# Altium project HSC_19e.PrjPcb
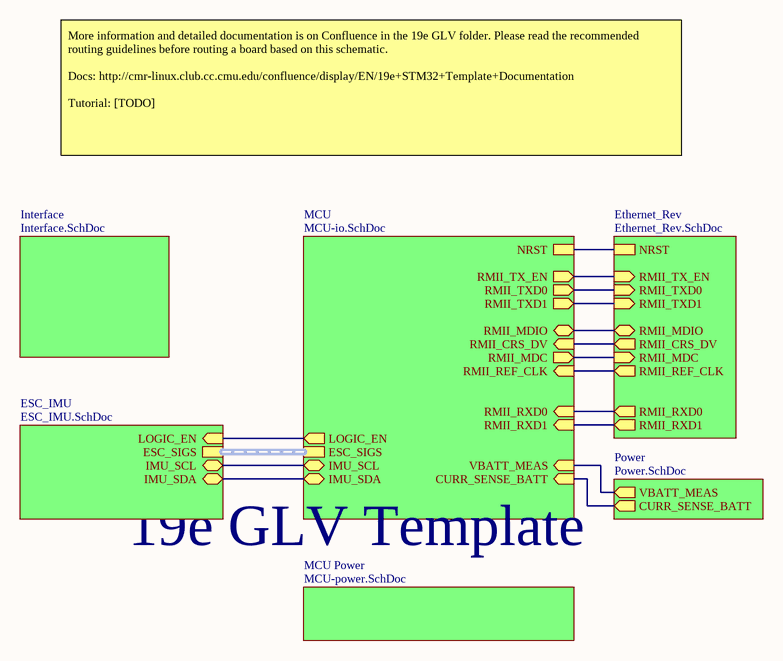
[diagram p0: Main.SchDoc]
7 sheets, 104 parts. Net scope: hierarchical (ports join the sheet entries above them; power ports are global).
Board file: PCB1.PcbDoc
Sheets:
  Main.SchDoc
    MCU = MCU-io.SchDoc
    Power = Power.SchDoc
    MCU Power = MCU-power.SchDoc
    Interface = Interface.SchDoc
    ESC_IMU = ESC_IMU.SchDoc
    Ethernet_Rev = Ethernet_Rev.SchDoc

## Sheet Main.SchDoc
size A

### Sub-sheets
ESC_IMU = ESC_IMU.SchDoc: IMU_SCL (bidir), LOGIC_EN (in), IMU_SDA (bidir), ESC_SIGS (harness ESC_SIG)
Ethernet_Rev = Ethernet_Rev.SchDoc: RMII_RXD1 (out), RMII_TXD1 (in), RMII_MDC (in), RMII_CRS_DV (out), RMII_RXD0 (out), RMII_REF_CLK (out), RMII_MDIO (bidir), RMII_TXD0 (in), RMII_TX_EN (in), NRST
Interface = Interface.SchDoc: no entries
MCU = MCU-io.SchDoc: CURR_SENSE_BATT (in), VBATT_MEAS (in), NRST, RMII_TXD1 (out), LOGIC_EN (out), ESC_SIGS (harness ESC_SIG), RMII_MDIO (bidir), RMII_CRS_DV (in), RMII_RXD0 (in), RMII_MDC (out), IMU_SDA (bidir), RMII_TX_EN (out), RMII_TXD0 (out), RMII_REF_CLK (in), IMU_SCL (bidir), RMII_RXD1 (in)
MCU Power = MCU-power.SchDoc: no entries
Power = Power.SchDoc: CURR_SENSE_BATT (out), VBATT_MEAS (out)

### Nets
CURR_SENSE_BATT: sheet MCU/CURR_SENSE_BATT, sheet Power/CURR_SENSE_BATT
I2C1_SCL: sheet MCU/IMU_SCL, sheet ESC_IMU/IMU_SCL
I2C1_SDA: sheet MCU/IMU_SDA, sheet ESC_IMU/IMU_SDA
LOGIC_EN: sheet MCU/LOGIC_EN, sheet ESC_IMU/LOGIC_EN
NRST: sheet MCU/NRST, sheet Ethernet_Rev/NRST
RMII_CRS_DV: sheet MCU/RMII_CRS_DV, sheet Ethernet_Rev/RMII_CRS_DV
RMII_MDC: sheet MCU/RMII_MDC, sheet Ethernet_Rev/RMII_MDC
RMII_MDIO: sheet MCU/RMII_MDIO, sheet Ethernet_Rev/RMII_MDIO
RMII_REF_CLK: sheet MCU/RMII_REF_CLK, sheet Ethernet_Rev/RMII_REF_CLK
RMII_RXD0: sheet MCU/RMII_RXD0, sheet Ethernet_Rev/RMII_RXD0
RMII_RXD1: sheet MCU/RMII_RXD1, sheet Ethernet_Rev/RMII_RXD1
RMII_TX_EN: sheet MCU/RMII_TX_EN, sheet Ethernet_Rev/RMII_TX_EN
RMII_TXD0: sheet MCU/RMII_TXD0, sheet Ethernet_Rev/RMII_TXD0
RMII_TXD1: sheet MCU/RMII_TXD1, sheet Ethernet_Rev/RMII_TXD1
VBATT_MEAS: sheet MCU/VBATT_MEAS, sheet Power/VBATT_MEAS

### Buses and harness runs
harness sheet ESC_IMU/ESC_SIGS = sheet MCU/ESC_SIGS

### Notes on the sheet
- More information and detailed documentation is on Confluence in the 19e GLV folder. Please read the recommended routing guidelines before routing a board based on this schematic.
  Docs: http://cmr-linux.club.cc.cmu.edu/confluence/display/EN/19e+STM32+Template+Documentation
  Tutorial: [TODO]
- 19e GLV Template

## Sheet MCU-io.SchDoc
size A4
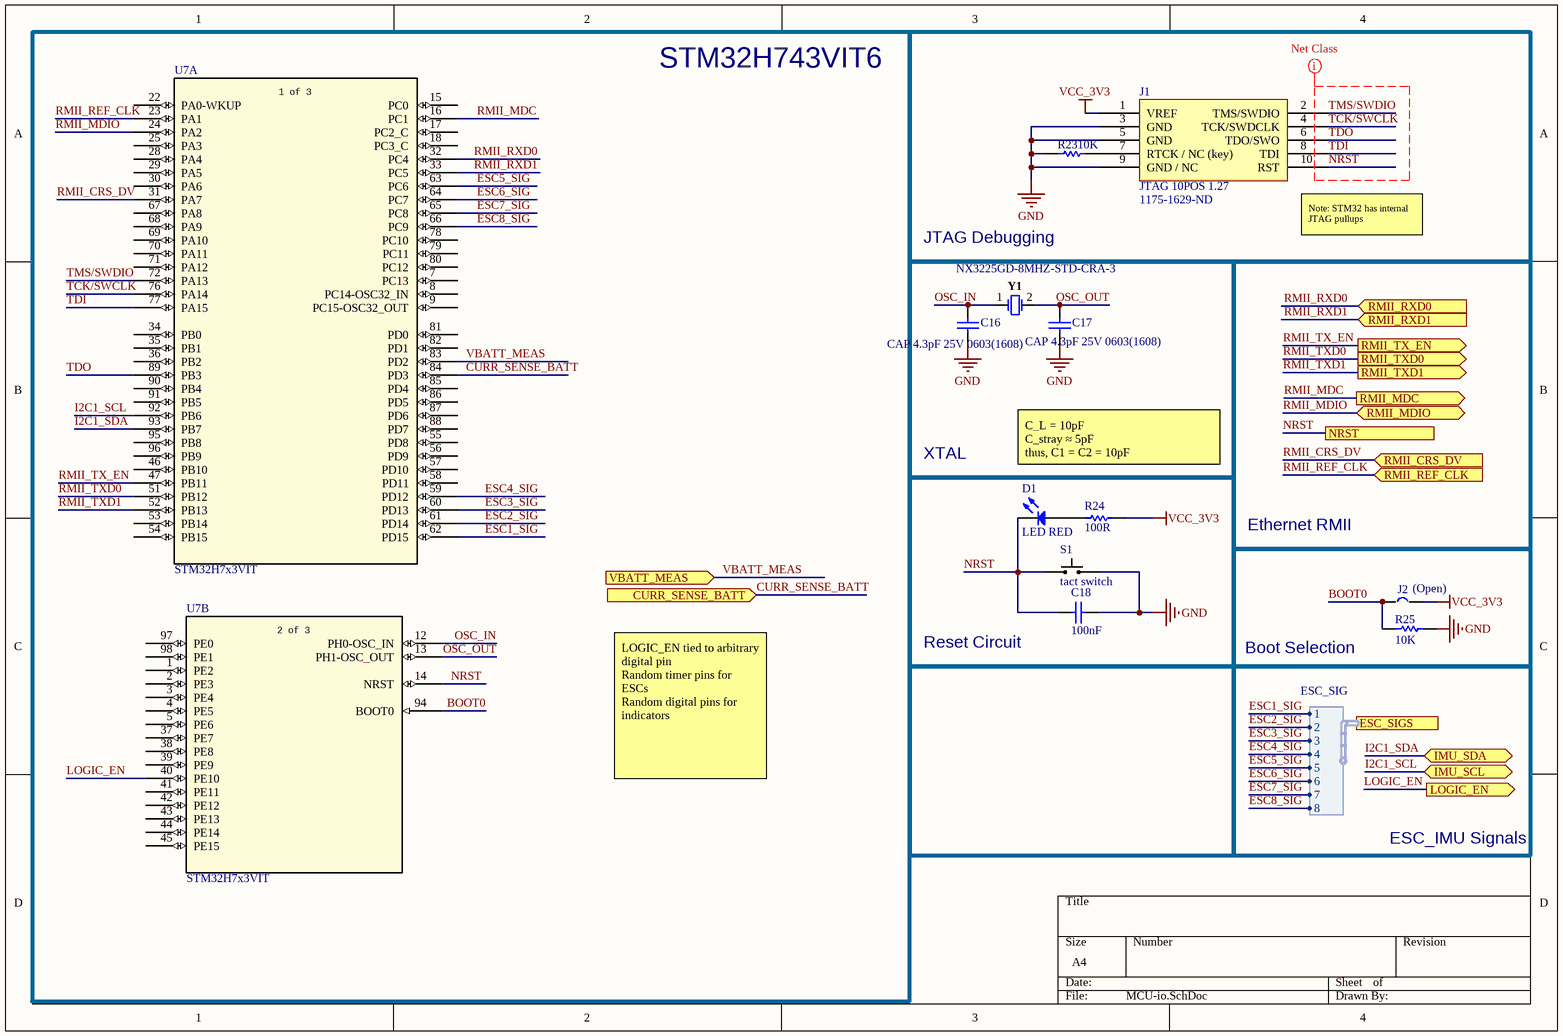
[diagram p1: MCU-io.SchDoc]

### Parts
C16  CAP 4.3pF 25V 0603(1608)  [CAPC0603(1608)100_L]
C17  CAP 4.3pF 25V 0603(1608)  [CAPC0603(1608)100_L]
C18  100nF  [CAPC0603(1608)100_N]
D1  LED RED  [LED_0805]
J1  JTAG 10POS 1.27  Supplier Part Number 1: 1175-1629-ND  [5x2 JTAG SMD]
J2  (Open)  [Solder Jumper]
R23  10K  [RESC0603(1608)_N]
R24  100R  [RESC0603(1608)_L]
R25  10K  [RESC0603(1608)_N]
S1  tact switch  [EVP-AA202K]
U7  STM32H7x3VIT  [LQFP100-14x14mm]  (parts A,B of 3)
Y1  NX3225GD-8MHZ-STD-CRA-3  [NDK-NX3225GD-8MHZ-STD-CRA-3_V]

### Blocks framed on the sheet
STM32H743VIT6: U7
JTAG Debugging: J1 R23

### Ports
CURR_SENSE_BATT (in), ESC_SIGS (harness ESC_SIG), IMU_SCL (bidir), IMU_SDA (bidir), LOGIC_EN (out), NRST, RMII_CRS_DV (in), RMII_MDC (out), RMII_MDIO (bidir), RMII_REF_CLK (in), RMII_RXD0 (in), RMII_RXD1 (in), RMII_TX_EN (out), RMII_TXD0 (out), RMII_TXD1 (out), VBATT_MEAS (in)

### Harnesses
ESC_SIG: 1, 2, 3, 4, 5, 6, 7, 8

### Nets
GND: C16.1 C17.1 C18.1 J1.3(GND) J1.5(GND) J1.9(GND_/_NC) R23.1 R25.2 S1.2
VCC_3V3: J1.1(VREF) J2.2 R24.2
BOOT0: J2.1 R25.1 U7.94(BOOT0)
CURR_SENSE_BATT: U7.84(PD3) ; port CURR_SENSE_BATT
ESC1_SIG: U7.62(PD15) ; port ESC_SIGS.1
ESC2_SIG: U7.61(PD14) ; port ESC_SIGS.2
ESC3_SIG: U7.60(PD13) ; port ESC_SIGS.3
ESC4_SIG: U7.59(PD12) ; port ESC_SIGS.4
ESC5_SIG: U7.63(PC6) ; port ESC_SIGS.5
ESC6_SIG: U7.64(PC7) ; port ESC_SIGS.6
ESC7_SIG: U7.65(PC8) ; port ESC_SIGS.7
ESC8_SIG: U7.66(PC9) ; port ESC_SIGS.8
I2C1_SCL: U7.92(PB6) ; port IMU_SCL
I2C1_SDA: U7.93(PB7) ; port IMU_SDA
LOGIC_EN: U7.40(PE10) ; port LOGIC_EN
NRST: C18.2 D1.1(K) J1.10(RST) S1.1 U7.14(NRST) ; port NRST
OSC_IN: C16.2 U7.12(PH0-OSC_IN) Y1.1
OSC_OUT: C17.2 U7.13(PH1-OSC_OUT) Y1.2
RMII_CRS_DV: U7.31(PA7) ; port RMII_CRS_DV
RMII_MDC: U7.16(PC1) ; port RMII_MDC
RMII_MDIO: U7.24(PA2) ; port RMII_MDIO
RMII_REF_CLK: U7.23(PA1) ; port RMII_REF_CLK
RMII_RXD0: U7.32(PC4) ; port RMII_RXD0
RMII_RXD1: U7.33(PC5) ; port RMII_RXD1
RMII_TX_EN: U7.47(PB11) ; port RMII_TX_EN
RMII_TXD0: U7.51(PB12) ; port RMII_TXD0
RMII_TXD1: U7.52(PB13) ; port RMII_TXD1
TCK/SWCLK: J1.4(TCK/SWDCLK) U7.76(PA14)
TDI: J1.8(TDI) U7.77(PA15)
TDO: J1.6(TDO/SWO) U7.89(PB3)
TMS/SWDIO: J1.2(TMS/SWDIO) U7.72(PA13)
VBATT_MEAS: U7.83(PD2) ; port VBATT_MEAS
NetD1_2: D1.2(A) R24.1
NetJ1_7: J1.7(RTCK_/_NC_(key)) R23.2

Not connected (* = marked no-connect by the designer): U7 1(PE2) 2(PE3) 3(PE4) 4(PE5) 5(PE6) 7(PC13) 8(PC14-OSC32_IN) 9(PC15-OSC32_OUT) 15(PC0) 17(PC2_C) 18(PC3_C) 22(PA0-WKUP) 25(PA3) 28(PA4) 29(PA5) 30(PA6) 34(PB0) 35(PB1) 36(PB2) 37(PE7) 38(PE8) 39(PE9) 41(PE11) 42(PE12) 43(PE13) 44(PE14) 45(PE15) 46(PB10) 53(PB14) 54(PB15) 55(PD8) 56(PD9) 57(PD10) 58(PD11) 67(PA8) 68(PA9) 69(PA10) 70(PA11) 71(PA12) 78(PC10) 79(PC11) 80(PC12) 81(PD0) 82(PD1) 85(PD4) 86(PD5) 87(PD6) 88(PD7) 90(PB4) 91(PB5) 95(PB8) 96(PB9) 97(PE0) 98(PE1)

### Layout directives
net class JTAG: NRST, TCK/SWCLK, TDI, TDO, TMS/SWDIO

### Notes on the sheet
- (near J1) Note: STM32 has internal JTAG pullups
- XTAL
- C_L = 10pF
  C_stray ≈ 5pF
  thus, C1 = C2 = 10pF
- Ethernet RMII
- Reset Circuit
- Boot Selection
- LOGIC_EN tied to arbitrary digital pin
  Random timer pins for ESCs
  Random digital pins for indicators
- ESC_IMU Signals
- (in symbol STM32H7x3VIT, part A) 1 of 3
- (in symbol STM32H7x3VIT, part B) 2 of 3

### Library data of the parts
C16 C17 = CMP-1035-00303-1: CAP 4.3pF 25V ±0.5pF 0603 (1608 Metric) Thickness 1mm SMD; Case-EIA: 0603; Tolerance: Â±0.5pF; Case-Metric: 1608; Value: 4.3pF; Technology: SMT; Max Thickness: 1 mm; Rated Voltage: 25 V
C18 = CMP-1035-02580-1: CAP 100nF 10V ±10% 0603 (1608 Metric) Thickness 1mm SMD; Tolerance: Â±10%; Case-EIA: 0603; Case-Metric: 1608; Max Thickness: 1 mm; Value: 100nF; Rated Voltage: 10 V; Technology: SMT
D1 = LED0: led; Manufacturer: Lite-On Inc.; Manufacturer Part Number: LTST-C171KRKT; Lens Color: Colorless; Lens Transparency: Clear; Millicandela Rating: 54mcd; Lens Style/Size: Rectangle with Flat Top, 1.40mm x 1.25mm; Voltage - Forward (Vf) (Typ): 2V; Current - Test: 20mA; Viewing Angle: 130°; Wavelength - Dominant: 631nm; Wavelength - Peak: 639nm; Supplier 1: Digi-Key; Supplier Part Number 1: 160-1427-1-ND; RoHS: RoHS Compliant; Category: Optoelectronics; Stock 1: 260544; Pricing 1: 1=0.31, 10=0.225, 25=0.1656, 100=0.1183, 250=0.0804, 500=0.07096, 1000=0.05558 (USD); Packaging: Cut Tape (CT); Part Status: Active; Color: Red; Mounting Type: Surface Mount; Features: -; Package / Case: 0805 (2012 Metric); Size / Dimension: 2.00mm L x 1.25mm W; Height (Max): 0.80mm; ComponentLink1URL: http://optoelectronics.liteon.com/upload/download/DS22-2000-109/LTST-C171KRKT.pdf; ComponentLink1Description: http://optoelectronics.liteon.com/upload/download/DS22-2000-109/LTST-C171KRKT.pdf
J1 = jtag 10pos mini: Supplier 1: Digi-Key
J2 = Jumper
R23 R25 = CMP-1012-00098-1: 10K 0.1W 5% 0603 (1608 Metric)  SMD; Case-EIA: 0603; Value: 10000.00 Ohm; Case-Metric: 1608; Technology: SMT; Tolerance: 5 %; Power: 0.1 W
R24 = CMP-1012-00050-1: 100R 0.1W 5% 0603 (1608 Metric)  SMD; Case-EIA: 0603; Value: 100.00 Ohm; Case-Metric: 1608; Tolerance: 5 %; Technology: SMT; Power: 0.1 W
S1 = EVP-AA Switch: EVP-AA Momentary Switch SPST-NO; Part Number: EVP-AA202K; Supplier 1: Digi-Key; Supplier Part Number 1: P13348SCT-ND; Datasheet: http://industrial.panasonic.com/lecs/www-data/pdf/ATK0000/ATK0000CE26.pdf
U7 = STM32H7x3VIT: Imported; Vendor: STMicroelectronics; Copyright: Copyright (C) 2016 Accelerated Designs. All rights reserved; Manufacturer_Part_Number: stm32h7x3vit; RefDes: RefDes; Type: DEV; Value: Value
Y1 = CMP-2000-07595-1: Crystal Unit, 8 MHz, 8 pF, -40 to 150 degC, 2-Pin SMD, RoHS, Tape and Reel; Manufacturer: NDK; Load Capacitance: 8pF; ESR (Equivalent Series Resistance): 500Ohm; Frequency Tolerance: 50ppm; Frequency Stability: 150ppm; Frequency: 8MHz; Case/Package: SMD/SMT; Datasheet Version: 11/2016; Min Operating Temperature: -40degC; Packaging: TapeandReel; Width: 0.098inch; Package Quantity: 3000; Number of Pins: 2; Package Description: 2-Pin Surface Mount Device, Body 3.2 x 2.5 mm; RoHSCompliant: True; Package Reference: NX3225GD-8MHZ-STD-CRA-3; Datasheet URL: http://www.ndk.com/images/products/catalog/c_NX3225GD-STD-CRA-3_e.pdf; Mounting Technology: SurfaceMount; Length: 0.126inch; Mount: SurfaceMount; Manufacturer URL: http://www.ndk.com/en/; Max Operating Temperature: 150degC; Height: 0.039inch

## Sheet Power.SchDoc
size A
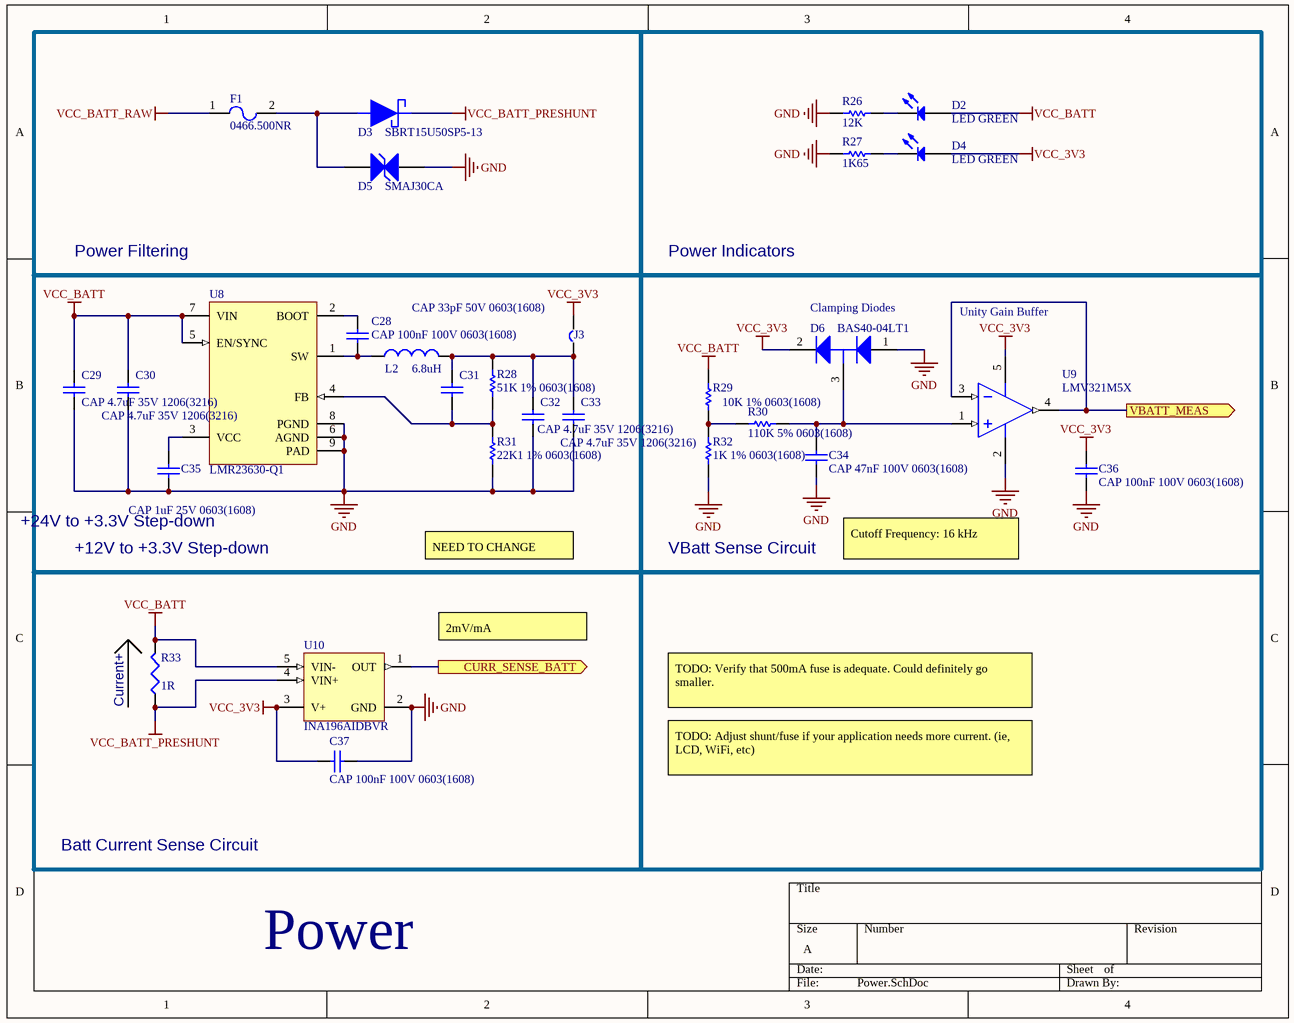
[diagram p2: Power.SchDoc]

### Parts
C28  CAP 100nF 100V 0603(1608)  [CAPC0603(1608)100_L]
C29  CAP 4.7uF 35V 1206(3216)  [CAPC1206(3216)190_L]
C30  CAP 4.7uF 35V 1206(3216)  [CAPC1206(3216)190_L]
C31  CAP 33pF 50V 0603(1608)  [CAPC0603(1608)100_M]
C32  CAP 4.7uF 35V 1206(3216)  [CAPC1206(3216)190_L]
C33  CAP 4.7uF 35V 1206(3216)  [CAPC1206(3216)190_L]
C34  CAP 47nF 100V 0603(1608)  [CAPC0603(1608)100_N]
C35  CAP 1uF 25V 0603(1608)  [CAPC0603(1608)100_L]
C36  CAP 100nF 100V 0603(1608)  [CAPC0603(1608)100_L]
C37  CAP 100nF 100V 0603(1608)  [CAPC0603(1608)100_L]
D2  LED GREEN  [LED_0805]
D3  SBRT15U50SP5-13  [SBRT15U50SP5-13]
D4  LED GREEN  [LED_0805]
D5  SMAJ30CA  [LFUS-DO-214AC-A-2_V]
D6  BAS40-04LT1  [ONSC-SOT-23-3-318-08_V]
F1  0466.500NR  [0466.500NR]
J3  (Open)  [Solder Jumper]  (value not drawn)  (no BOM)
L2  6.8uH  [BOURNS SRP5030T]
R26  12K  [RESC0603(1608)_N]
R27  1K65  [RESC0603(1608)_N]
R28  51K 1% 0603(1608)  [RESC0603(1608)_N]
R29  10K 1% 0603(1608)  [RESC0603(1608)_N]
R30  110K 5% 0603(1608)  [RESC0603(1608)_M]
R31  22K1 1% 0603(1608)  [RESC0603(1608)_N]
R32  1K 1% 0603(1608)  [RESC0603(1608)_M]
R33  value 1R  [C1206]
U8  LMR23630-Q1  [DDA0008E_N]
U9  LMV321M5X  [DBV0005A_N]
U10  INA196AIDBVR  [DBV0005A_L]

### Blocks framed on the sheet
Power Filtering: D3 D5 F1
Power Indicators: D2 D4 R26 R27
+12V to +3.3V Step-down: C28-C33 C35 J3 L2 R28 R31 U8
VBatt Sense Circuit: C34 C36 D6 R29 R30 R32 U9
Batt Current Sense Circuit: C37 R33 U10

### Ports
CURR_SENSE_BATT (out), VBATT_MEAS (out)

### Nets
GND: C29.1 C30.1 C32.1 C33.1 C34.1 C35.1 C36.2 C37.1 D5.2(A) D6.1(A) R26.1 R27.1 R31.1 R32.1 U8.6(AGND) U8.8(PGND) U8.9(PAD) U9.2(V-) U10.2(GND)
VCC_3V3: C36.1 C37.2 D4.2(A) D6.2(K) J3.2 U9.5(V+) U10.3(V+)
VCC_BATT: C29.2 C30.2 D2.2(A) R29.2 R33.2 U8.5(EN/SYNC) U8.7(VIN) U10.5(VIN-)
VCC_BATT_PRESHUNT: D3.2 R33.1 U10.4(VIN+)
VCC_BATT_RAW: F1.1
CURR_SENSE_BATT: U10.1(OUT) ; port CURR_SENSE_BATT
VBATT_MEAS: U9.3(IN-) U9.4(OUT) ; port VBATT_MEAS
NetC28_1: C28.1 L2.1 U8.1(SW)
NetC28_2: C28.2 U8.2(BOOT)
NetC31_1: C31.1 R28.1 R31.2 U8.4(FB)
NetC31_2: C31.2 C32.2 C33.2 J3.1 L2.2 R28.2
NetC34_2: C34.2 D6.3(K/A) R30.2 U9.1(IN+)
NetC35_2: C35.2 U8.3(VCC)
NetD2_1: D2.1(K) R26.2
NetD3_1: D3.1 D5.1(A) F1.2
NetD4_1: D4.1(K) R27.2
NetR29_1: R29.1 R30.1 R32.2

### Notes on the sheet
- (near D6) Clamping Diodes
- Unity Gain Buffer
- (near C35) +24V to +3.3V Step-down
- NEED TO CHANGE VALUES
- Cutoff Frequency: 16 kHz
- 2mV/mA
- (near R33) Current+
- TODO: Verify that 500mA fuse is adequate. Could definitely go smaller.
- TODO: Adjust shunt/fuse if your application needs more current. (ie, LCD, WiFi, etc)
- Power

### Library data of the parts
C28 C36 C37 = CMP-1035-02595-1: CAP 100nF 100V ±10% 0603 (1608 Metric) Thickness 1mm SMD; Tolerance: Â±10%; Case-EIA: 0603; Case-Metric: 1608; Rated Voltage: 100 V; Value: 100nF; Technology: SMT; Max Thickness: 1 mm
C29 C30 C32 C33 = CMP-1037-04922-1: CAP 4.7uF 35V ±10% 1206 (3216 Metric) Thickness 1.9mm SMD; Case-EIA: 1206; Tolerance: Â±10%; Case-Metric: 3216; Rated Voltage: 35 V; Technology: SMT; Value: 4.7uF; Max Thickness: 1.9 mm
C31 = CMP-1035-00943-1: CAP 33pF 50V ±5% 0603 (1608 Metric) Thickness 1mm SMD; Tolerance: Â±5%; Case-EIA: 0603; Case-Metric: 1608; Rated Voltage: 50 V; Max Thickness: 1 mm; Technology: SMT; Value: 33pF
C34 = CMP-1035-02516-1: CAP 47nF 100V ±10% 0603 (1608 Metric) Thickness 1mm SMD; Case-Metric: 1608; Case-EIA: 0603; Tolerance: Â±10%; Rated Voltage: 100 V; Value: 47nF; Max Thickness: 1 mm; Technology: SMT
C35 = CMP-1035-02740-1: CAP 1uF 25V ±10% 0603 (1608 Metric) Thickness 1mm SMD; Tolerance: Â±10%; Case-Metric: 1608; Case-EIA: 0603; Technology: SMT; Rated Voltage: 25 V; Max Thickness: 1 mm; Value: 1uF
D2 D4 = LED0: led; Manufacturer: Lite-On Inc.; Manufacturer Part Number: LTST-C171KGKT; Lens Color: Colorless; Lens Transparency: Clear; Millicandela Rating: 35mcd; Lens Style/Size: Rectangle with Flat Top, 1.40mm x 1.25mm; Voltage - Forward (Vf) (Typ): 2V; Current - Test: 20mA; Viewing Angle: 130°; Wavelength - Dominant: 571nm; Wavelength - Peak: 574nm; Supplier 1: Digi-Key; Supplier Part Number 1: 160-1426-1-ND; RoHS: RoHS Compliant; Category: Optoelectronics; Stock 1: 350441; Pricing 1: 1=0.31, 10=0.225, 25=0.1656, 100=0.1183, 250=0.0804, 500=0.07096, 1000=0.05558 (USD); Packaging: Cut Tape (CT); Part Status: Active; Color: Green; Mounting Type: Surface Mount; Features: -; Package / Case: 0805 (2012 Metric); Size / Dimension: 2.00mm L x 1.25mm W; Height (Max): 0.90mm; ComponentLink1URL: http://optoelectronics.liteon.com/upload/download/DS22-2000-118/LTST-C171KGKT.pdf; ComponentLink1Description: http://optoelectronics.liteon.com/upload/download/DS22-2000-118/LTST-C171KGKT.pdf
D5 = CMP-2000-07088-1: Transient Voltage Suppression Diode, 30 V, -65 to 150 degC, 2-Pin SMD, RoHS, Tape and Reel; Manufacturer: Littelfuse-Inc.; Current - Peak Pulse (10/1000µs): 8.3A; Power - Peak Pulse: 400W; Voltage - Breakdown (Min): 33.3V; Bidirectional Channels: 1; Power Line Protection: No; Voltage - Clamping (Max) @ Ipp: 48.4V; Voltage - Reverse Standoff (Typ): 30V; Type: Zener; Category: CircuitProtection; Datasheet Version: 11/2015; Package Description: 2-Pin Surface Mount Device, Body 4.295 x 2.595 mm; Family: TVS-Diodes; Manufacturer URL: http://www.littelfuse.com/; Series: SMAJ; Package / Case: DO-214AC,SMA; Capacitance @ Frequency: -; Package Reference: DO-214AC; Packaging: Digi-Reel®; Applications: GeneralPurpose; Mounting Technology: SurfaceMount; Mounting Type: SurfaceMount; Unidirectional Channels: -; Supplier Device Package: DO-214AC(SMA); Operating Temperature: -55°C~150°C(TJ); Datasheet URL: http://www.littelfuse.com/~/media/electronics/datasheets/tvs_diodes/littelfuse_tvs_diode_smaj_datasheet.pdf.pdf
D6 = CMP-1055-00528-1: Dual Series Schottky Barrier Diodes, 3-Pin SOT-23, Tape and Reel; Manufacturer: On Semiconductor; PartNumber: BAS40-04LT1; Packing: Tape and Reel; PackageReference: SOT-23-3-318-08; ComponentLink1URL: http://www.onsemi.com/; PackageVersion: Rev. AP, 11/2009; ComponentLink2Description: Datasheet; Mounting Technology: Surface Mount; Configuration: Series; ComponentLink1Description: Manufacturer URL; RoHS: FALSE; ComponentLink3Description: Package Specification; ComponentLink2URL: http://www.onsemi.cn/pub_link/Collateral/BAS40-04LT1-D.PDF; DatasheetVersion: Rev. 11; PackageDescription: 3-Pin Small Outline Transistor, Body 2.92 x 1.3 mm, Pitch 0.95 mm; ComponentLink3URL: http://www.onsemi.cn/pub_link/Collateral/318-08.PDF
F1 = 0466.500NR: FUSE BOARD MOUNT 500MA 63VAC/VDC; Supplier: DigiKey; Part Number: 0466.500NR; Supplier Part Number: F1454CT-ND; Datasheet URL: http://www.littelfuse.com/~/media/electronics/datasheets/fuses/littelfuse_fuse_466_datasheet.pdf.pdf
J3 = Jumper
L2 = SRP5030TA: Manufacturer: Bourns Inc.; Manufacturer Part Number: SRP5030TA-6R8M; Type: Wirewound; Material - Core: Carbonyl Powder; Tolerance: ±20%; Shielding: Shielded; DC Resistance (DCR): 76.2 mOhm Max; Q @ Freq: 15 @ 100kHz; Supplier 1: Digi-Key; RoHS: RoHS Compliant; Category: Inductors, Coils, Chokes; Stock 1: 5626; Pricing 1: 1=1.51, 10=1.397, 100=0.9781, 500=0.79178, 1000=0.72191 (USD); Packaging: Cut Tape (CT); Part Status: Active; Ratings: AEC-Q200; Operating Temperature: -40°C ~ 150°C; Mounting Type: Surface Mount; Package / Case: Nonstandard; Supplier Device Package: -; Size / Dimension: 0.224" L x 0.205" W (5.70mm x 5.20mm); Height - Seated (Max): 0.118" (3.00mm); ComponentLink1URL: http://www.bourns.com/docs/Product-Datasheets/SRP5030TA.pdf; ComponentLink1Description: http://www.bourns.com/docs/Product-Datasheets/SRP5030TA.pdf; Supplier Part Number 1: SRP5030TA-6R8MCT-ND
R26 R27 = CMP-1012-00050-1: as R24 on sheet MCU-io; Tolerance: 5 %; Technology: SMT; Power: 0.1 W
R28 = CMP-1012-00703-1: 51K 0.1W 1% 0603 (1608 Metric)  SMD; Case-EIA: 0603; Case-Metric: 1608; Value: 51000.00 Ohm; Tolerance: 1 %; Technology: SMT; Power: 0.1 W
R29 = CMP-1012-00623-1: 10K 0.1W 1% 0603 (1608 Metric)  SMD; Value: 10000.00 Ohm; Case-EIA: 0603; Case-Metric: 1608; Power: 0.1 W; Tolerance: 1 %; Technology: SMT
R30 = CMP-1012-00123-1: 110K 0.1W 5% 0603 (1608 Metric)  SMD; Value: 110000.00 Ohm; Case-Metric: 1608; Case-EIA: 0603; Tolerance: 5 %; Power: 0.1 W; Technology: SMT
R31 = CMP-1012-00660-1: 22K1 0.1W 1% 0603 (1608 Metric)  SMD; Case-EIA: 0603; Case-Metric: 1608; Value: 22100.00 Ohm; Tolerance: 1 %; Power: 0.1 W; Technology: SMT
R32 = CMP-1012-00510-1: 1K 0.1W 1% 0603 (1608 Metric)  SMD; Case-Metric: 1608; Case-EIA: 0603; Value: 1000.00 Ohm; Technology: SMT; Tolerance: 1 %; Power: 0.1 W
R33 = Res3: Resistor; Manufacturer 1: Susumu; Manufacturer Part Number 1: RL1632R-1R00-F; Power Rating: 500mW; Tolerance: 1%; Temperature Coefficient: 100ppm/°C; Published: 8-Jun-2000; LatestRevisionDate: 29-May-2009; LatestRevisionNote: IPC-7351 Footprint Added.; PackageReference: J1-0603; Publisher: Altium Limited; PackageDescription: Chip Resistor; Supplier 1: Digi-Key; Supplier Part Number 1: RL16R1.0FCT-ND; Stock 1: 37831; Pricing 1: 1=0.68, 10=0.485, 25=0.3784, 50=0.3202, 100=0.2523, 250=0.2134, 500=0.1746, 1000=0.1358 (USD); Case/Package: 1206; Weight: 0.000571oz; Case Code (Metric): 3216; Case Code (Imperial): 1206; Min Operating Temperature: -55°C; Max Operating Temperature: 125°C; Package Quantity: 1; Resistance: 1R; Packaging: Tape and Reel; Composition: Thin Film; Number of Terminations: 2; Termination: SMD/SMT; Max Power Dissipation: 500mW; Length: 0.126inch; Height: 0.026inch; Width: 0.063inch; Lead Free: Lead Free; ComponentLink1URL: https://datasheet.ciiva.com/2490/rl-data-sheet-2490384.pdf; ComponentLink1Description: https://datasheet.ciiva.com/2490/rl-data-sheet-2490384.pdf; ComponentLink2URL: https://datasheet.ciiva.com/12838/e-15-16-12838646.pdf; ComponentLink2Description: https://datasheet.ciiva.com/12838/e-15-16-12838646.pdf; ComponentLink3URL: https://datasheet.ciiva.com/2490/rl-data-sheet-2490382.pdf; ComponentLink3Description: https://datasheet.ciiva.com/2490/rl-data-sheet-2490382.pdf; ComponentLink4URL: https://datasheet.ciiva.com/2490/rl-data-sheet-2490383.pdf; ComponentLink4Description: https://datasheet.ciiva.com/2490/rl-data-sheet-2490383.pdf
U8 = LMR23630-Q1: Manufacturer: Texas Instruments; Manufacturer Part Number: LMR23630AFQDDARQ1; Function: Step-Down; Output Configuration: Positive; Topology: Buck; Output Type: Adjustable; Number of Outputs: 1; Voltage - Input (Min): 4.5V; Voltage - Input (Max): 36V; Voltage - Output (Min/Fixed): 1V; Voltage - Output (Max): 28V; Current - Output: 3A; Frequency - Switching: 400kHz; Synchronous Rectifier: Yes; Supplier 1: Digi-Key; Supplier Part Number 1: 296-45260-6-ND; Stock 1: 1636; Pricing 1: 1=3.97, 10=3.564, 100=2.9204, 500=2.48604, 1000=2.09667 (USD); RoHS: RoHS Compliant; Category: Integrated Circuits (ICs); Packaging: Digi-Reel®; Part Status: Active; Operating Temperature: -40°C ~ 125°C (TJ); Mounting Type: Surface Mount; Package / Case: 8-SOIC (0.154", 3.90mm Width) Exposed Pad; Supplier Device Package: 8-SO PowerPad; ComponentLink1URL: http://www.ti.com/lit/ds/symlink/lmr23630-q1.pdf; ComponentLink1Description: http://www.ti.com/lit/ds/symlink/lmr23630-q1.pdf
U9 = CMP-0055-01048-3: General Purpose, Low Voltage, Rail-to-Rail Output Operational Amplifiers, 5-pin SOT-23; Manufacturer: Texas Instruments; PackageTopMarking: A13*XTT; PowerWise: N; ComponentLink1Description: Datasheet URL; CompType: Amplifiers; ComponentLink1URL: http://www.ti.com/general/docs/lit/getliterature.tsp?genericPartNumber=LMV321-N&fileType=pdf; PinCount: 5; PackageDescription: Molded SOT-23, .115 x .063 x .040 in Body, 5 Lead, .0375 in Pitch; RoHS: N; Package Reference: DBV0005A
U10 = CMP-0704-00014-2: Voltage Output High-Side Measurement Current Shunt Monitor, 2.7 to 18 V, -40 to 125 degC, 5-pin SOT23 (DBV5), Green (RoHS & no Sb/Br); Manufacturer: Texas Instruments; Common Mode Range(Max)(V): 80; Rating: Catalog; Input Offset (+/-)(Max)(uV): 2000; Vs(Min)(V): 2.7; Gain(V/V): 20; Vs(Max)(V): 18; Small-Signal Bandwidth(Typ)(MHz): 0.5; Quiescent Current (+/-)(Typ)(mA): 0.7; Common Mode Range(Min)(V): -16; PartNumber: INA196AIDBVR; SubFamily: Current Shunt Monitor; ComponentLink2Description: Datasheet; ComponentLink1Description: Manufacturer URL; CMRR(Min)(dB): 80; PackageVersion: 4073253-4/K, 03/2006; Output Type: Voltage; ComponentLink3Description: Package Specification; DatasheetVersion: SBOS307F; ComponentLink3URL: http://www.ti.com/lit/ml/mpds018j/mpds018j.pdf; Mounting Technology: Surface Mount; ComponentLink2URL: http://www.ti.com/general/docs/lit/getliterature.tsp?genericPartNumber=INA196&fileType=pdf; PackageReference: DBV0005A; ComponentLink1URL: http://www.ti.com/; Eco-Plan: Green (RoHS & no Sb/Br); Code_JEDEC: MO-178; PackageDescription: 5-Pin Plastic Small Outline, Body 1.6 x 2.9 mm, Pitch 0.95 mm
D3 = SBRT15U50SP5-13: Supplier 1: Digi-Key; Supplier Part Number 1: SBRT15U50SP5-13DICT-ND

## Sheet MCU-power.SchDoc
size A
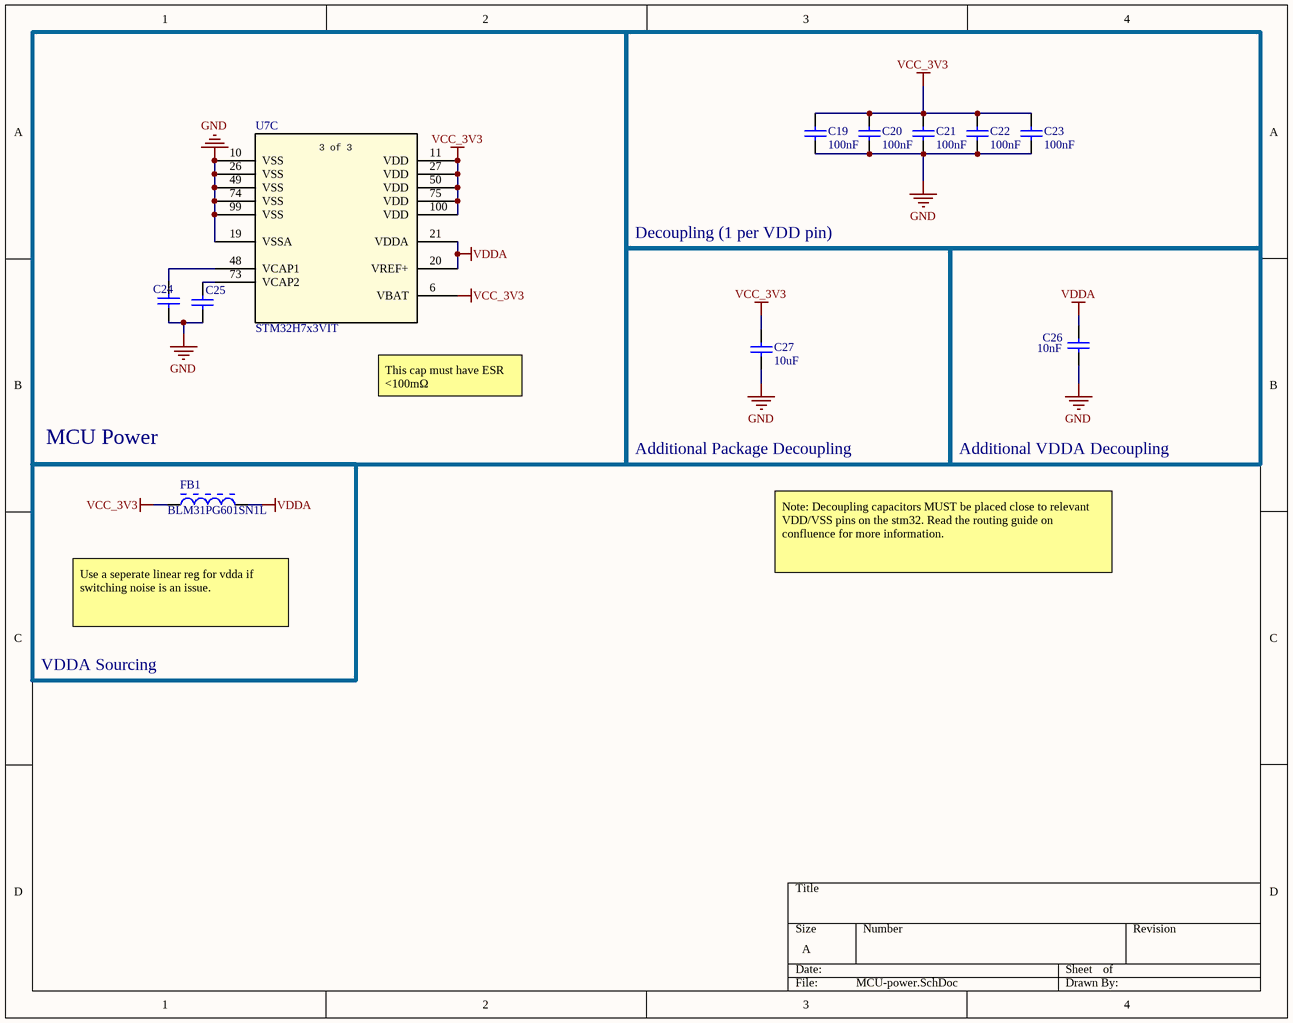
[diagram p3: MCU-power.SchDoc]

### Parts
C19  100nF  [CAPC0603(1608)100_N]
C20  100nF  [CAPC0603(1608)100_N]
C21  100nF  [CAPC0603(1608)100_N]
C22  100nF  [CAPC0603(1608)100_N]
C23  100nF  [CAPC0603(1608)100_N]
C24  CAP 2.2uF 10V 0603(1608)  [CAPC0603(1608)100_N]  (value not drawn)
C25  CAP 2.2uF 10V 0603(1608)  [CAPC0603(1608)100_N]  (value not drawn)
C26  10nF  [CAPC0603(1608)100_M]
C27  10uF  [CAPC0603(1608)100_N]
FB1  BLM31PG601SN1L  [MURA-BLM31-B-CHIP-2_V]
U7  STM32H7x3VIT  [LQFP100-14x14mm]  (part C of 3)

### Blocks framed on the sheet
Decoupling (1 per VDD pin): C19-C23
Additional VDDA Decoupling: C26
MCU Power: FB1

### Nets
GND: C19.1 C20.1 C21.1 C22.1 C23.1 C24.1 C25.1 C26.2 C27.1 U7.10(VSS) U7.19(VSSA) U7.26(VSS) U7.49(VSS) U7.74(VSS) U7.99(VSS)
VCC_3V3: C19.2 C20.2 C21.2 C22.2 C23.2 C27.2 FB1.1 U7.6(VBAT) U7.11(VDD) U7.27(VDD) U7.50(VDD) U7.75(VDD) U7.100(VDD)
VDDA: C26.1 FB1.2 U7.20(VREF+) U7.21(VDDA)
NetC24_2: C24.2 U7.48(VCAP1)
NetC25_2: C25.2 U7.73(VCAP2)

### Notes on the sheet
- This cap must have ESR <100mΩ
- Additional Package Decoupling
- Note: Decoupling capacitors MUST be placed close to relevant VDD/VSS pins on the stm32. Read the routing guide on confluence for more information.
- Use a seperate linear reg for vdda if switching noise is an issue.
- VDDA Sourcing
- (in symbol STM32H7x3VIT, part C) 3 of 3

### Library data of the parts
C19-C23 = CMP-1035-02580-1: as C18 on sheet MCU-io; Max Thickness: 1 mm; Value: 100nF; Rated Voltage: 10 V; Technology: SMT
C24 C25 = CMP-1035-02761-1: CAP 2.2uF 10V -20% to +80% 0603 (1608 Metric) Thickness 1mm SMD; Case-EIA: 0603; Case-Metric: 1608; Value: 2.2uF; Rated Voltage: 10 V; Tolerance: -20% to +80%; Max Thickness: 1 mm; Technology: SMT
C26 = CMP-1035-02306-1: CAP 10nF 10V ±10% 0603 (1608 Metric) Thickness 1mm SMD; Tolerance: Â±10%; Case-EIA: 0603; Case-Metric: 1608; Rated Voltage: 10 V; Value: 10nF; Technology: SMT; Max Thickness: 1 mm
C27 = CMP-1035-02799-1: CAP 10uF 10V ±10% 0603 (1608 Metric) Thickness 1mm SMD; Tolerance: Â±10%; Case-Metric: 1608; Case-EIA: 0603; Max Thickness: 1 mm; Technology: SMT; Rated Voltage: 10 V; Value: 10uF
FB1 = CMP-0686-00744-2: Chip Ferrite Bead for Power Lines, 600 Ohm, 1500 mA, -55 to 125 degC, 3.2 x 1.6 x 1.3 mm SMD, Tape and Reel; Manufacturer: Murata; DC Resistance: 0.08 Ohm Max.; Impedance (at 100 MHz): 600 Ohm +/- 25%; Rated Current: 1500 mA; ComponentLink1URL: http://www.murata.com/; ComponentLink3Description: Package Specification; DatasheetVersion: 08/2013; PartNumber: BLM31PG601SN1L; Mounting Technology: Surface Mount; ComponentLink3URL: http://www.murata.com/products/catalog/pdf/c31e.pdf; ComponentLink2Description: Datasheet; PackageDescription: 2-Pin Chip, Body 3.2 x 1.6 mm; Operating Temperature Range: -55 to 125 degC; ComponentLink1Description: Manufacturer URL; ComponentLink2URL: http://www.murata.com/products/catalog/pdf/c31e.pdf; PackageReference: BLM31-2; Packing: Tape and Reel
U7 = STM32H7x3VIT: Imported; Vendor: STMicroelectronics; Copyright: Copyright (C) 2016 Accelerated Designs. All rights reserved; Manufacturer_Part_Number: stm32h7x3vit; RefDes: RefDes; Type: DEV; Value: Value

## Sheet Interface.SchDoc
size A
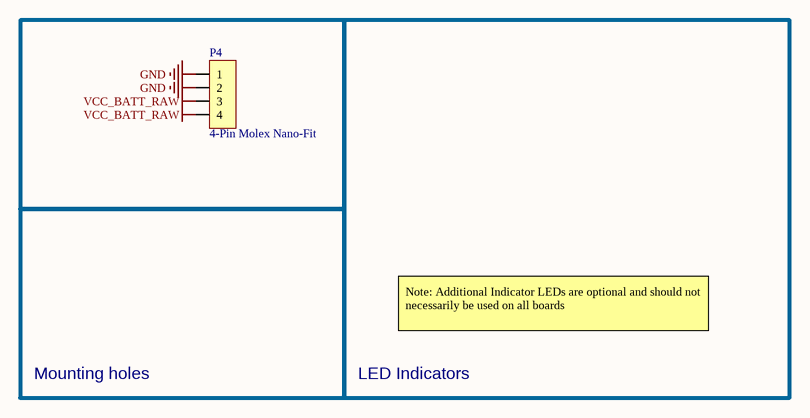
[diagram p4: Interface.SchDoc]

### Parts
P4  4-Pin Molex Nano-Fit  [MOLEX NANO-FIT 1X4]

### Nets
GND: P4.1 P4.2
VCC_BATT_RAW: P4.3 P4.4

### Notes on the sheet
- Note: Additional Indicator LEDs are optional and should not necessarily be used on all boards
- Mounting holes
- LED Indicators

### Library data of the parts
P4 = 4-Pin Nano-Fit: NanoFit RA Hdr TH SR 4Ckt; Part Number: 105313-1204; Supplier: Mouser; Manufacturer: Molex; Supplier Part Number: 538-105313-1204

## Sheet ESC_IMU.SchDoc
size A
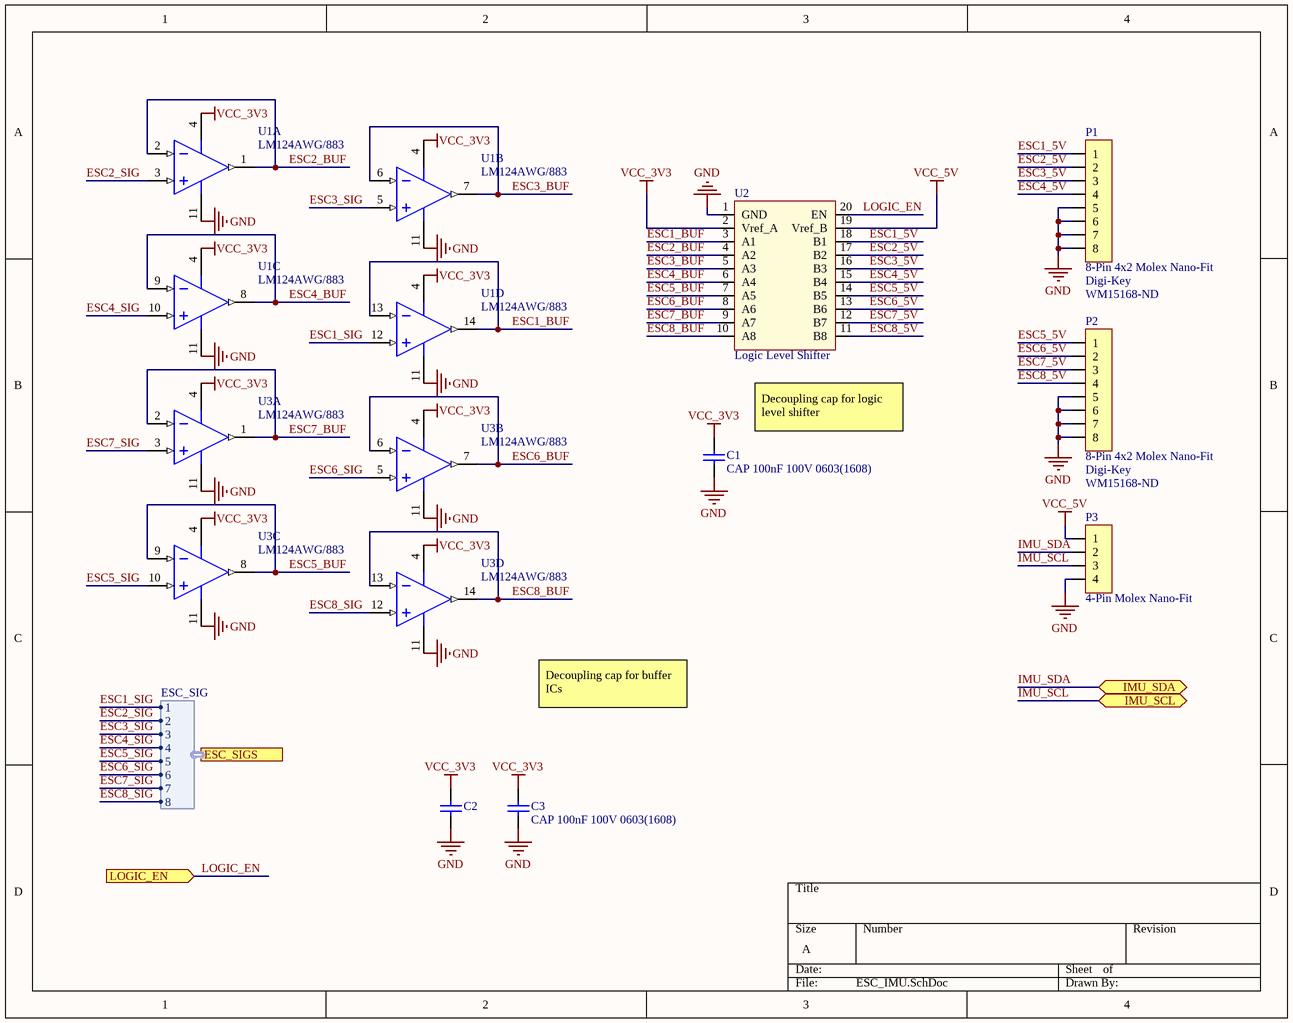
[diagram p5: ESC_IMU.SchDoc]

### Parts
C1  CAP 100nF 100V 0603(1608)  [CAPC0603(1608)100_L]
C2  CAP 100nF 100V 0603(1608)  [CAPC0603(1608)100_L]  (value not drawn)
C3  CAP 100nF 100V 0603(1608)  [CAPC0603(1608)100_L]
P1  8-Pin 4x2 Molex Nano-Fit  Supplier 1: Digi-Key  Supplier Part Number 1: WM15168-ND  [MOLEX NANO-FIT 2x4]
P2  8-Pin 4x2 Molex Nano-Fit  Supplier 1: Digi-Key  Supplier Part Number 1: WM15168-ND  [MOLEX NANO-FIT 2x4]
P3  4-Pin Molex Nano-Fit  [MOLEX NANO-FIT 1X4]
U1  LM124AWG/883  [NAC0014A_L]  (parts A,B,C,D of 4)
U2  Logic Level Shifter  [TSOP65P640X120-20N]
U3  LM124AWG/883  [NAC0014A_L]  (parts A,B,C,D of 4)

### Ports
ESC_SIGS (harness ESC_SIG), IMU_SCL (bidir), IMU_SDA (bidir), LOGIC_EN (in)

### Harnesses
ESC_SIG: 1, 2, 3, 4, 5, 6, 7, 8

### Nets
GND: C1.2 C2.2 C3.2 P1.5 P1.6 P1.7 P1.8 P2.5 P2.6 P2.7 P2.8 P3.4 U1.11(GND) U2.1(GND) U3.11(GND)
VCC_3V3: C1.1 C2.1 C3.1 U1.4(V+) U2.2(Vref_A) U3.4(V+)
VCC_5V: P3.1 U2.19(Vref_B)
ESC1_5V: P1.1 U2.18(B1)
ESC1_BUF: U1.13(IN4-) U1.14(OUT4) U2.3(A1)
ESC1_SIG: U1.12(IN4+) ; port ESC_SIGS.1
ESC2_5V: P1.2 U2.17(B2)
ESC2_BUF: U1.1(OUT1) U1.2(IN1-) U2.4(A2)
ESC2_SIG: U1.3(IN1+) ; port ESC_SIGS.2
ESC3_5V: P1.3 U2.16(B3)
ESC3_BUF: U1.6(IN2-) U1.7(OUT2) U2.5(A3)
ESC3_SIG: U1.5(IN2+) ; port ESC_SIGS.3
ESC4_5V: P1.4 U2.15(B4)
ESC4_BUF: U1.8(OUT3) U1.9(IN3-) U2.6(A4)
ESC4_SIG: U1.10(IN3+) ; port ESC_SIGS.4
ESC5_5V: P2.1 U2.14(B5)
ESC5_BUF: U2.7(A5) U3.8(OUT3) U3.9(IN3-)
ESC5_SIG: U3.10(IN3+) ; port ESC_SIGS.5
ESC6_5V: P2.2 U2.13(B6)
ESC6_BUF: U2.8(A6) U3.6(IN2-) U3.7(OUT2)
ESC6_SIG: U3.5(IN2+) ; port ESC_SIGS.6
ESC7_5V: P2.3 U2.12(B7)
ESC7_BUF: U2.9(A7) U3.1(OUT1) U3.2(IN1-)
ESC7_SIG: U3.3(IN1+) ; port ESC_SIGS.7
ESC8_5V: P2.4 U2.11(B8)
ESC8_BUF: U2.10(A8) U3.13(IN4-) U3.14(OUT4)
ESC8_SIG: U3.12(IN4+) ; port ESC_SIGS.8
IMU_SCL: P3.3 ; port IMU_SCL  [project net I2C1_SCL]
IMU_SDA: P3.2 ; port IMU_SDA  [project net I2C1_SDA]
LOGIC_EN: U2.20(EN) ; port LOGIC_EN

### Notes on the sheet
- Decoupling cap for logic level shifter
- Decoupling cap for buffer ICs

### Library data of the parts
C1-C3 = CMP-1035-02595-1: as C28 on sheet Power; Rated Voltage: 100 V; Value: 100nF; Technology: SMT; Max Thickness: 1 mm
P1 P2 = 8-Pin 2-Row Nano-Fit: NanoFit RA Hdr TH DR 8Ckt; Part Number: 105314-1216; Supplier: Digi-Key; Manufacturer: Molex; Supplier Part Number: WM15165-ND
P3 = 4-Pin Nano-Fit: as P4 on sheet Interface; Supplier: Mouser; Manufacturer: Molex; Supplier Part Number: 538-105313-1204
U1 U3 = CMP-0055-00919-3: Low Power Quad Operational Amplifier, 14-pin CerPACK; Manufacturer: Texas Instruments; High-Reliability: Y; PackageTopMarking: NSZSSXXYYA*LM124AWG/*883 Q*7704302XA; PowerWise: N; CompType: Amplifiers; RoHS: N; Package Reference: NAC0014A; PackageDescription: Cerpack, .390 x .250 x .070in, 14 Lead, .050in Pitch, Gull Wing; ComponentLink1URL: http://www.ti.com/general/docs/lit/getliterature.tsp?genericPartNumber=LM124AQML&fileType=pdf; ComponentLink1Description: Datasheet URL; PinCount: 14; PartId: 1
U2 = TI LSF0108-Q1: ComponentLink1Description: digikey; ComponentLink1URL: https://www.digikey.com/product-detail/en/texas-instruments/LSF0108QPWRQ1/296-44247-1-ND/6098479

## Sheet Ethernet_Rev.SchDoc
size A4
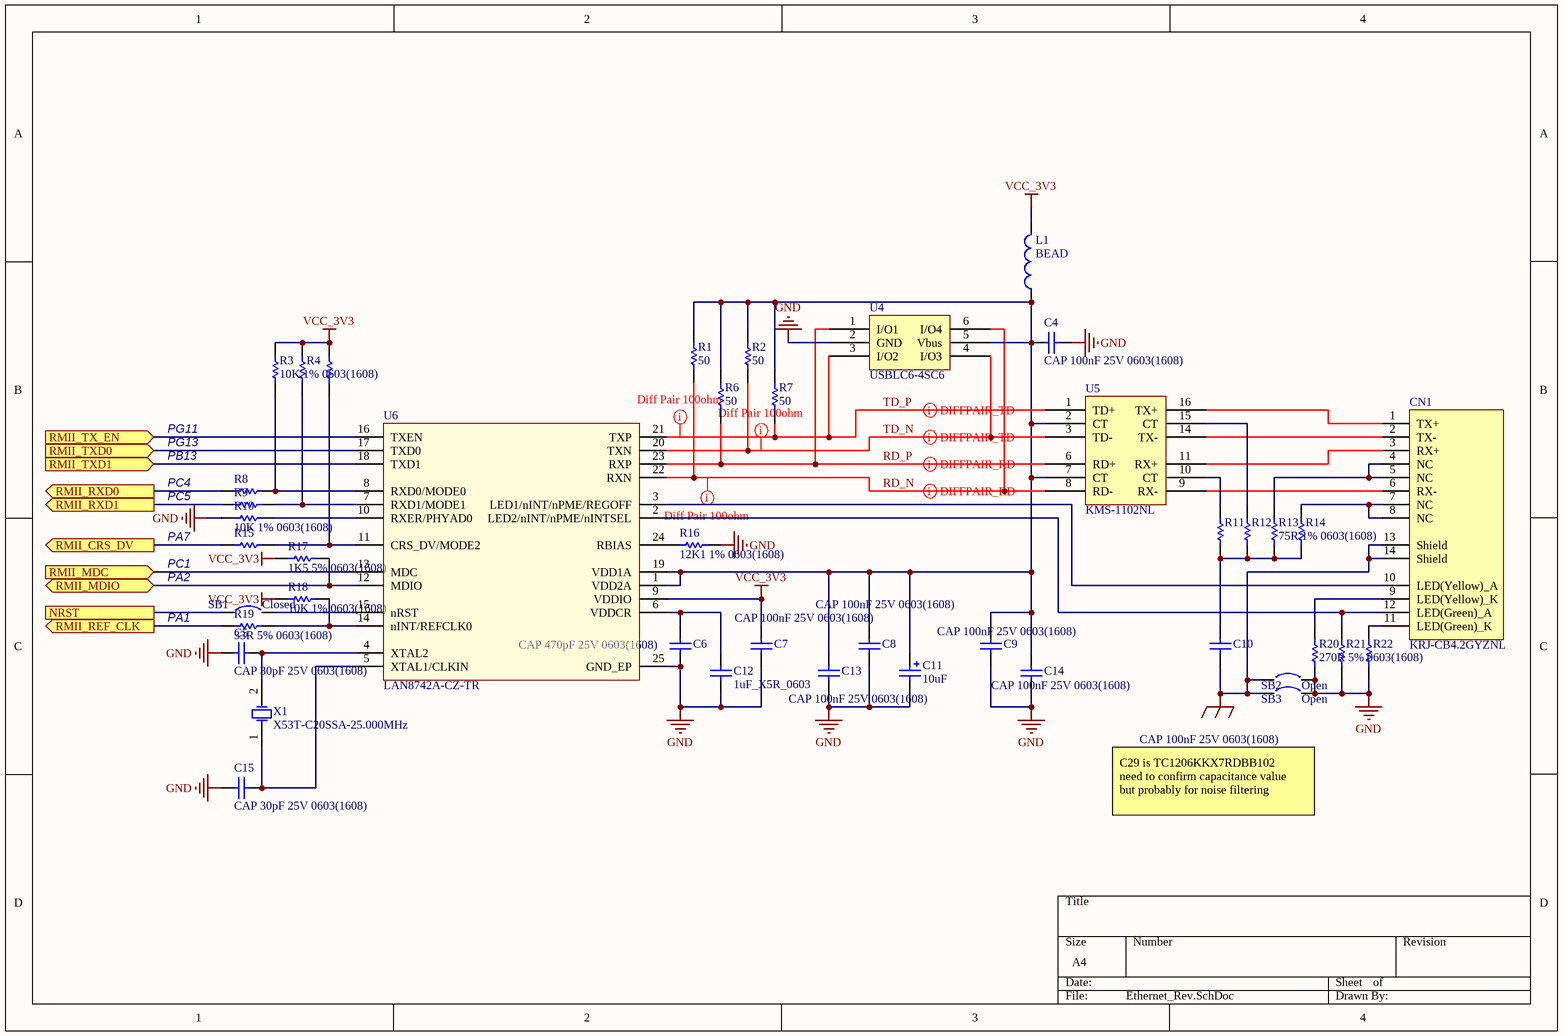
[diagram p6: Ethernet_Rev.SchDoc]

### Parts
C4  CAP 100nF 25V 0603(1608)  [CAPC0603(1608)100_N]
C5  CAP 30pF 25V 0603(1608)  [CAPC0603(1608)100_N]
C6  CAP 470pF 25V 0603(1608)  [CAPC0603(1608)100_M]
C7  CAP 100nF 25V 0603(1608)  [CAPC0603(1608)100_N]
C8  CAP 100nF 25V 0603(1608)  [CAPC0603(1608)100_N]
C9  CAP 100nF 25V 0603(1608)  [CAPC0603(1608)100_N]
C10  CAP 100nF 25V 0603(1608)  [CAPC0603(1608)100_N]
C11  10uF  [TAN-A]
C12  1uF_X5R_0603  [0603C]
C13  CAP 100nF 25V 0603(1608)  [CAPC0603(1608)100_N]
C14  CAP 100nF 25V 0603(1608)  [CAPC0603(1608)100_N]
C15  CAP 30pF 25V 0603(1608)  [CAPC0603(1608)100_N]
CN1  KRJ-CB4.2GYZNL  [RJ45_KRJ-CB4.2GYZNL]
L1  BEAD  [0603L]
R1  50  [0603R]
R2  50  [0603R]
R3  10K 1% 0603(1608)  [RESC0603(1608)_N]
R4  10K 1% 0603(1608)  [RESC0603(1608)_N]  (value not drawn)
R5  10K 1% 0603(1608)  [RESC0603(1608)_N]  (value not drawn)
R6  50  [0603R]
R7  50  [0603R]
R8  33R 5% 0603(1608)  [RESC0603(1608)_M]  (value not drawn)
R9  33R 5% 0603(1608)  [RESC0603(1608)_M]  (value not drawn)
R10  10K 1% 0603(1608)  [RESC0603(1608)_N]
R11  75R 1% 0603(1608)  [RESC0603(1608)_M]  (value not drawn)
R12  75R 1% 0603(1608)  [RESC0603(1608)_M]  (value not drawn)
R13  75R 1% 0603(1608)  [RESC0603(1608)_M]
R14  75R 1% 0603(1608)  [RESC0603(1608)_M]  (value not drawn)
R15  33R 5% 0603(1608)  [RESC0603(1608)_M]  (value not drawn)
R16  12K1 1% 0603(1608)  [RESC0603(1608)_M]
R17  1K5 5% 0603(1608)  [RESC0603(1608)_M]
R18  10K 1% 0603(1608)  [RESC0603(1608)_N]
R19  33R 5% 0603(1608)  [RESC0603(1608)_M]
R20  270R 5% 0603(1608)  [RESC0603(1608)_N]
R21  270R 5% 0603(1608)  [RESC0603(1608)_N]  (value not drawn)
R22  270R 5% 0603(1608)  [RESC0603(1608)_N]  (value not drawn)
SB1  Closed  [SB_0603]
SB2  Open  [SB_0603]
SB3  Open  [SB_0603]
U4  USBLC6-4SC6  [SOT23-6L]
U5  KMS-1102NL  [Transformer]
U6  LAN8742A-CZ-TR  [QFN24_0R5_4X4]
X1  X53T-C20SSA-25.000MHz  [XTAL_2SM_5R0X3R2]

### Ports
NRST, RMII_CRS_DV (out), RMII_MDC (in), RMII_MDIO (bidir), RMII_REF_CLK (out), RMII_RXD0 (out), RMII_RXD1 (out), RMII_TX_EN (in), RMII_TXD0 (in), RMII_TXD1 (in)

### Nets
EGND: C10.1 CN1.13(Shield) CN1.14(Shield) SB2.1 SB3.1
GND: C4.2 C5.1 C6.1 C7.1 C8.1 C9.1 C11.2 C12.2 C13.1 C14.1 C15.1 R10.1 R16.2 R20.1 R21.1 R22.1 SB2.2 SB3.2 U4.2(GND) U6.25(GND_EP)
VCC_3V3: C7.2 L1.2 R3.2 R4.2 R5.2 R17.1 R18.1 U6.9(VDDIO)
NRST: SB1.1 ; port NRST
RD_N: R1.1 U4.6(I/O4) U5.8(RD-) U6.22(RXN)
RD_P: R6.1 U4.1(I/O1) U5.6(RD+) U6.23(RXP)
RMII_CRS_DV: R15.1 ; port RMII_CRS_DV
RMII_MDC: U6.13(MDC) ; port RMII_MDC
RMII_MDIO: R17.2 U6.12(MDIO) ; port RMII_MDIO
RMII_REF_CLK: R19.1 ; port RMII_REF_CLK
RMII_RXD0: R8.1 ; port RMII_RXD0
RMII_RXD1: R9.1 ; port RMII_RXD1
RMII_TX_EN: U6.16(TXEN) ; port RMII_TX_EN
RMII_TXD0: U6.17(TXD0) ; port RMII_TXD0
RMII_TXD1: U6.18(TXD1) ; port RMII_TXD1
TD_N: R2.1 U4.4(I/O3) U5.3(TD-) U6.20(TXN)
TD_P: R7.1 U4.3(I/O2) U5.1(TD+) U6.21(TXP)
NetC4_1: C4.1 C8.2 C9.2 C11.1 C13.2 C14.2 L1.1 R1.2 R2.2 R6.2 R7.2 U4.5(Vbus) U5.2(CT) U5.7(CT) U6.1(VDD2A) U6.19(VDD1A)
NetC5_2: C5.2 U6.4(XTAL2) X1.2(OSC2)
NetC6_2: C6.2 C12.1 U6.6(VDDCR)
NetC10_2: C10.2 R11.1 R12.1 R13.1 R14.1
NetC15_2: C15.2 U6.5(XTAL1/CLKIN) X1.1(OSC1)
NetCN1_1: CN1.1(TX+) U5.16(TX+)
NetCN1_2: CN1.2(TX-) U5.14(TX-)
NetCN1_3: CN1.3(RX+) U5.11(RX+)
NetCN1_4: CN1.4(NC) CN1.5(NC) R13.2
NetCN1_6: CN1.6(RX-) U5.9(RX-)
NetCN1_7: CN1.7(NC) CN1.8(NC) R14.2
NetCN1_9: CN1.9(LED(Yellow)_K) R20.2
NetCN1_10: CN1.10(LED(Yellow)_A) U6.3(LED1/nINT/nPME/REGOFF)
NetCN1_11: CN1.11(LED(Green)_K) R22.2
NetCN1_12: CN1.12(LED(Green)_A) R21.2 U6.2(LED2/nINT/nPME/nINTSEL)
NetR3_1: R3.1 R8.2 U6.8(RXD0/MODE0)
NetR4_1: R4.1 R9.2 U6.7(RXD1/MODE1)
NetR5_1: R5.1 R15.2 U6.11(CRS_DV/MODE2)
NetR10_2: R10.2 U6.10(RXER/PHYAD0)
NetR11_2: R11.2 U5.10(CT)
NetR12_2: R12.2 U5.15(CT)
NetR16_1: R16.1 U6.24(RBIAS)
NetR18_2: R18.2 R19.2 U6.14(nINT/REFCLK0)
NetSB1_2: SB1.2 U6.15(nRST)

### Layout directives
differential pair: RD_N, RD_P, TD_N, TD_P
rule Matched Net Lengths [Tolerance = 100mil]: RD_N, TD_N, TD_P

### Notes on the sheet
- PG11
- PG13
- PB13
- PC4
- PC5
- PA7
- PC1
- PA2
- PA1
- C29 is TC1206KKX7RDBB102
  need to confirm capacitance value
  but probably for noise filtering

### Library data of the parts
C4 C7-C10 C13 C14 = CMP-1035-02587-1: CAP 100nF 25V ±5% 0603 (1608 Metric) Thickness 1mm SMD; Case-EIA: 0603; Tolerance: Â±5%; Case-Metric: 1608; Technology: SMT; Max Thickness: 1 mm; Rated Voltage: 25 V; Value: 100nF
C5 C15 = CMP-1035-00910-1: CAP 30pF 25V ±5% 0603 (1608 Metric) Thickness 1mm SMD; Case-EIA: 0603; Tolerance: Â±5%; Case-Metric: 1608; Max Thickness: 1 mm; Technology: SMT; Value: 30pF; Rated Voltage: 25 V
C6 = CMP-1035-01670-1: CAP 470pF 25V ±5% 0603 (1608 Metric) Thickness 1mm SMD; Tolerance: Â±5%; Case-Metric: 1608; Case-EIA: 0603; Rated Voltage: 25 V; Value: 470pF; Max Thickness: 1 mm; Technology: SMT
C11 = Cap_10uF_POL_10%_TANA: Polarized Capacitor,10uF,10V,10%,typeA,VISHAY; Manuf_Part_1: 293D106X9010A2TE3; Revision: July-2002: Re-released for DXP Platform.; Value: 10uF; Manuf_1: VISHAY; Order: *; ECCN_US/EU: n/a
C12 = CAP SMD 0603  X5R 1µF 25V 10%: 0603  X5R 1µF; Rated voltage: 25V; Tolerance: 10%; Manufacturer: *; Manufacturer P/N: *; Order code Farnell: 1288202RL; Value: 1µF; Power: *; Technology: X5R; Temperature  Factor: *; Temperature Max: +125°C; Temperature Min: -55°C; STS Code: *
CN1 = KRJ-CB4.2GYZNL: 100 Base-TX (Fast Ethernet) SMD RJ45 single port (1x1) with LEDS Integrated Magnetics Connector; Manuf_1: HanRun; Manuf_Part_1: HR961160C; Manuf_2: Pulse Electronics Corporation; Manuf_Part_2: J3011G21DNLT; Manuf_3: K.O.D International Holding; Manuf_Part_3: RMT-119A-12F6-GY-04; Distrib: Sub Co; Order: *
L1 = Inductor: Value: 100uH; Published: 8-Jun-2000; Revision: July-2002: Re-released for DXP Platform.; Publisher: Altium Limited
R1 R2 R6 R7 = Res_50_1%_0603: Resistor,50,0603,1%,YAGEO; Manuf_Part_1: RC0402FR-0750RL; Value: 50; Manuf_1: YAGEO; Order: *; ECCN_US/EU: n/a; Distrib: FARNELL
R3-R5 R10 R18 = CMP-1012-00623-1: as R29 on sheet Power; Power: 0.1 W; Tolerance: 1 %; Technology: SMT
R8 R9 R15 R19 = CMP-1012-00038-1: 33R 0.1W 5% 0603 (1608 Metric)  SMD; Value: 33.00 Ohm; Case-EIA: 0603; Case-Metric: 1608; Tolerance: 5 %; Technology: SMT; Power: 0.1 W
R11-R14 = CMP-1012-00383-1: 75R 0.1W 1% 0603 (1608 Metric)  SMD; Case-EIA: 0603; Value: 75.00 Ohm; Case-Metric: 1608; Power: 0.1 W; Technology: SMT; Tolerance: 1 %
R16 = CMP-1012-00632-1: 12K1 0.1W 1% 0603 (1608 Metric)  SMD; Case-Metric: 1608; Case-EIA: 0603; Value: 12100.00 Ohm; Power: 0.1 W; Technology: SMT; Tolerance: 1 %
R17 = CMP-1012-00078-1: 1K5 0.1W 5% 0603 (1608 Metric)  SMD; Case-Metric: 1608; Case-EIA: 0603; Value: 1500.00 Ohm; Technology: SMT; Power: 0.1 W; Tolerance: 5 %
R20-R22 = CMP-1012-00060-1: 270R 0.1W 5% 0603 (1608 Metric)  SMD; Case-Metric: 1608; Case-EIA: 0603; Value: 270.00 Ohm; Power: 0.1 W; Tolerance: 5 %; Technology: SMT
SB1 = Circuit Breaker_close: Circuit Breaker; Published: 24-Mar-1999; Revision: July-2002: Re-released for DXP Platform.; Publisher: Altium Limited
SB2 SB3 = Circuit Breaker: Published: 24-Mar-1999; Revision: July-2002: Re-released for DXP Platform.; Publisher: Altium Limited
U6 = LAN8742A-CZ-TR: LAN8742A-CZ-TR - Small Footprint RMII 10/100 Ethernet, Transceiver with HP Auto-MDIX and flexPWR Technology SQFN-24; Manuf_1: MICROCHIP; Order: LAN8742A-CZ-TR; Manuf_Part_1: LAN8742A-CZ-TR; Distrib: MICROCHIP
X1 = XTAL_5032: Crystal Oscillator; Published: 8-Jun-2000; LatestRevisionDate: 17-Jul-2002; LatestRevisionNote: Re-released for DXP Platform.; PackageReference: R38; Publisher: Altium Limited

## Nets that join several sheets
GND: MCU-io (9 pins), Power (19 pins), MCU-power (15 pins), Interface (P4.1 P4.2), ESC_IMU (15 pins), Ethernet_Rev (20 pins)
VCC_3V3: MCU-io (J1.1 J2.2 R24.2), Power (7 pins), MCU-power (13 pins), ESC_IMU (6 pins), Ethernet_Rev (8 pins)
VCC_BATT_RAW: Power (F1.1), Interface (P4.3 P4.4)
CURR_SENSE_BATT: MCU-io (U7.84), Power (U10.1)
ESC1_SIG: MCU-io (U7.62), ESC_IMU (U1.12)
ESC2_SIG: MCU-io (U7.61), ESC_IMU (U1.3)
ESC3_SIG: MCU-io (U7.60), ESC_IMU (U1.5)
ESC4_SIG: MCU-io (U7.59), ESC_IMU (U1.10)
ESC5_SIG: MCU-io (U7.63), ESC_IMU (U3.10)
ESC6_SIG: MCU-io (U7.64), ESC_IMU (U3.5)
ESC7_SIG: MCU-io (U7.65), ESC_IMU (U3.3)
ESC8_SIG: MCU-io (U7.66), ESC_IMU (U3.12)
I2C1_SCL: MCU-io (U7.92), ESC_IMU (P3.3)
I2C1_SDA: MCU-io (U7.93), ESC_IMU (P3.2)
LOGIC_EN: MCU-io (U7.40), ESC_IMU (U2.20)
NRST: MCU-io (5 pins), Ethernet_Rev (SB1.1)
RMII_CRS_DV: MCU-io (U7.31), Ethernet_Rev (R15.1)
RMII_MDC: MCU-io (U7.16), Ethernet_Rev (U6.13)
RMII_MDIO: MCU-io (U7.24), Ethernet_Rev (R17.2 U6.12)
RMII_REF_CLK: MCU-io (U7.23), Ethernet_Rev (R19.1)
RMII_RXD0: MCU-io (U7.32), Ethernet_Rev (R8.1)
RMII_RXD1: MCU-io (U7.33), Ethernet_Rev (R9.1)
RMII_TX_EN: MCU-io (U7.47), Ethernet_Rev (U6.16)
RMII_TXD0: MCU-io (U7.51), Ethernet_Rev (U6.17)
RMII_TXD1: MCU-io (U7.52), Ethernet_Rev (U6.18)
VBATT_MEAS: MCU-io (U7.83), Power (U9.3 U9.4)